# EAGLE design schema (EAGLE 9.6.0)
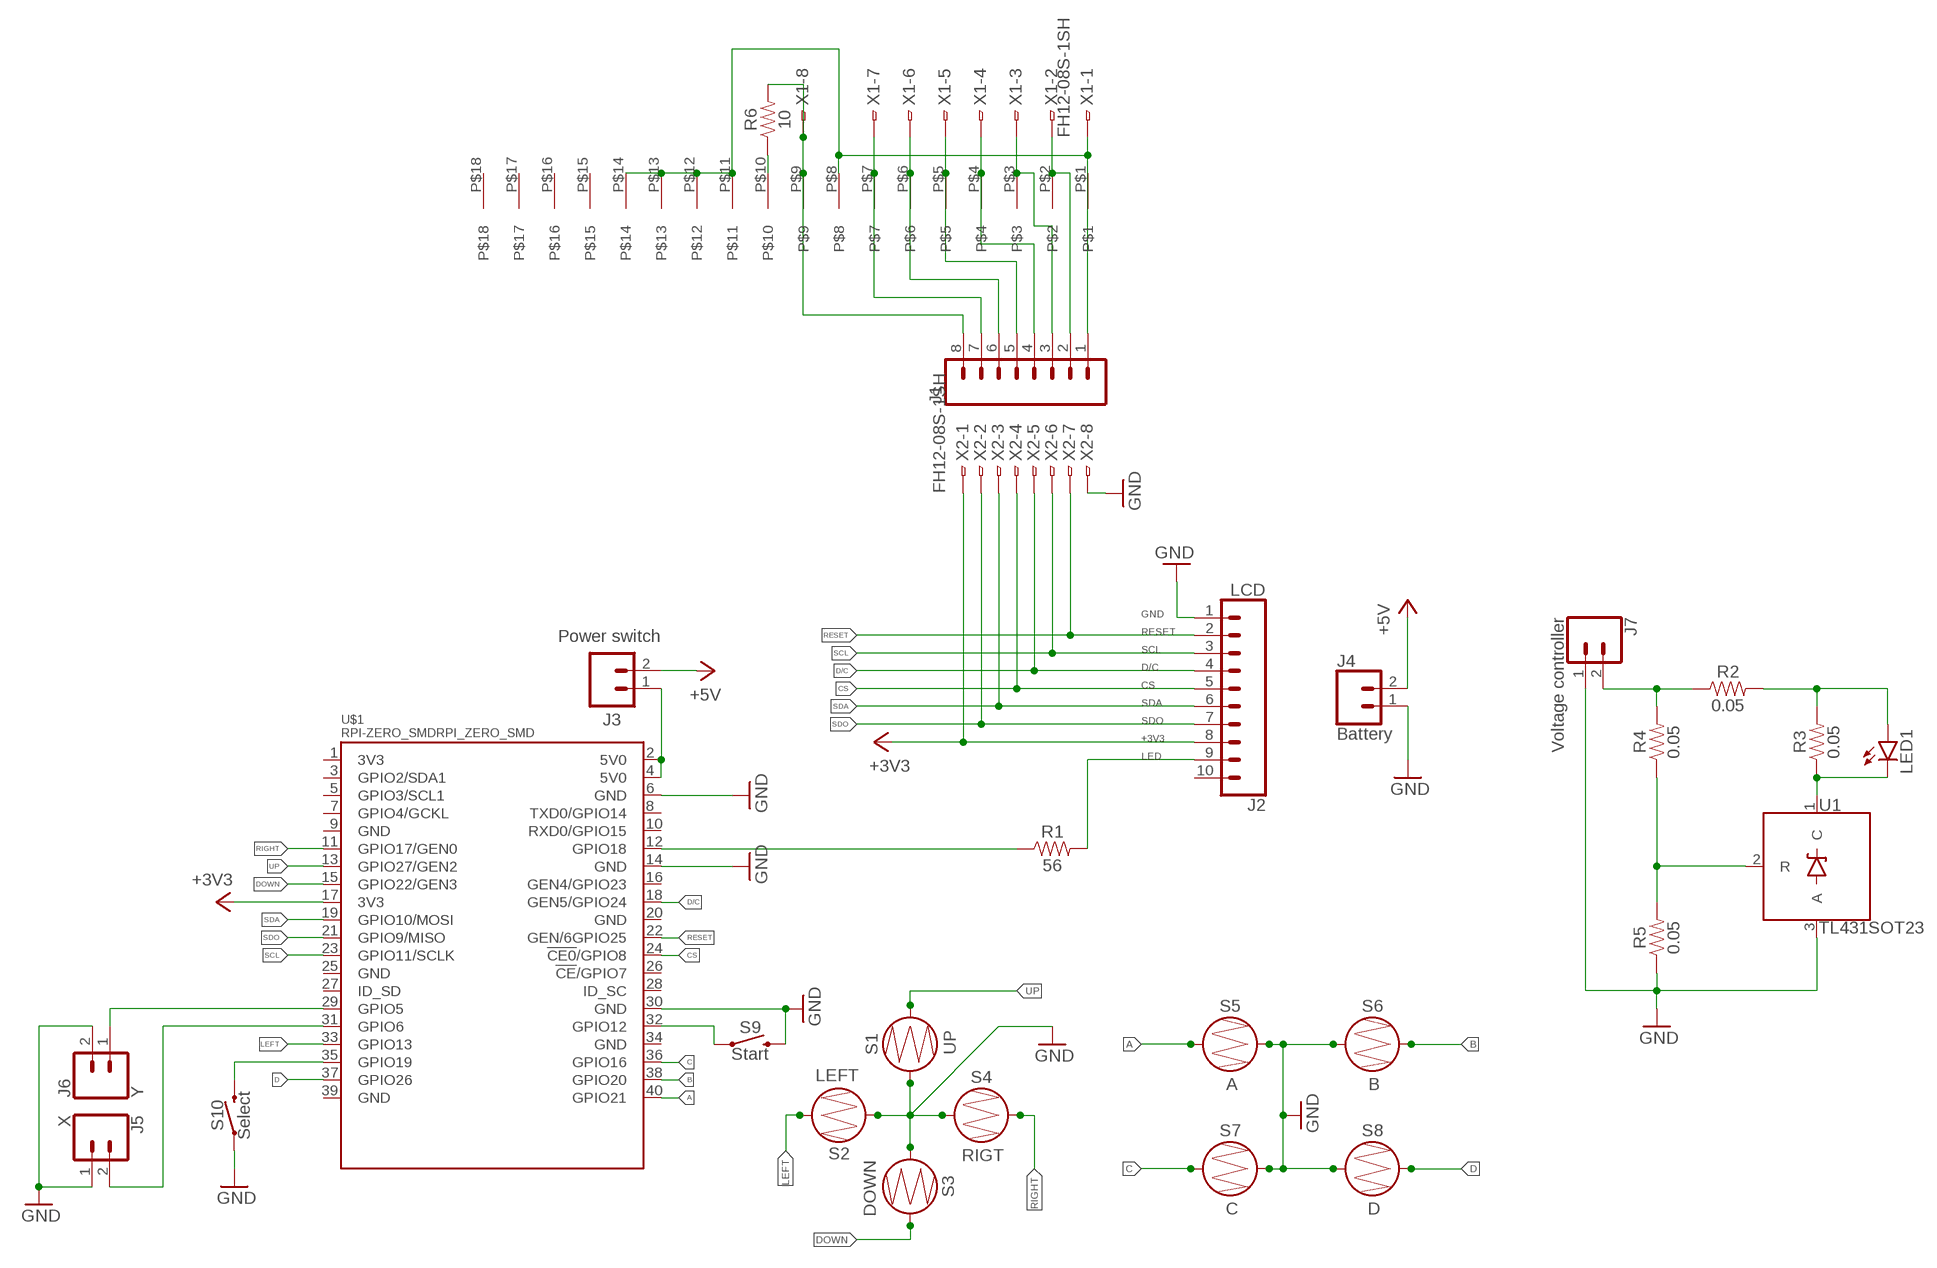
[diagram p0: schematic, sheet 1]

## Parts
J1  CONN_08"  [1X08]
J2  LCD  CONN_10NO_SILK_PTH_FEMALE  [1X10_NO_SILK]
J3  Power switch  CONN_02LOCK_LONGPADS  [1X02_LOCK_LONGPADS]
J4  Battery  CONN_02LOCK_LONGPADS  [1X02_LOCK_LONGPADS]
J5  X  CONN_02LOCK_LONGPADS  [1X02_LOCK_LONGPADS]
J6  Y  CONN_02LOCK_LONGPADS  [1X02_LOCK_LONGPADS]
J7  Voltage controller  CONN_02  [1X02]
LED1  LEDKA-3528ASYC  [KA-3528ASYC]
R1  56  0.05OHM-0603-1/5W-1%  [0603]
R2  0.05  0.05OHM-0603-1/5W-1%  [0603]
R3  0.05  0.05OHM-0603-1/5W-1%  [0603]
R4  0.05  0.05OHM-0603-1/5W-1%  [0603]
R5  0.05  0.05OHM-0603-1/5W-1%  [0603]
R6  10  0.05OHM-0603-1/5W-1%  [0603]
S1  UP  BUTTON-CONDUCTIVESMD  [BUTTON-CONDUCTIVE]
S2  LEFT  BUTTON-CONDUCTIVESMD  [BUTTON-CONDUCTIVE]
S3  DOWN  BUTTON-CONDUCTIVESMD  [BUTTON-CONDUCTIVE]
S4  RIGT  BUTTON-CONDUCTIVESMD  [BUTTON-CONDUCTIVE]
S5  A  BUTTON-CONDUCTIVESMD  [BUTTON-CONDUCTIVE]
S6  B  BUTTON-CONDUCTIVESMD  [BUTTON-CONDUCTIVE]
S7  C  BUTTON-CONDUCTIVESMD  [BUTTON-CONDUCTIVE]
S8  D  BUTTON-CONDUCTIVESMD  [BUTTON-CONDUCTIVE]
S9  Start  MOMENTARY-SWITCH-SPST-PTH-6.0MM-KIT  [TACTILE_SWITCH_PTH_6.0MM_KIT]
S10  Select  MOMENTARY-SWITCH-SPST-PTH-6.0MM-KIT  [TACTILE_SWITCH_PTH_6.0MM_KIT]
U1  TL431SOT23  [SOT23-3]
U$1  RPI-ZERO_SMDRPI_ZERO_SMD  [RASPBERRYPI_SMD]
U$2  ILI_LCD  [ILI_LCD]
X1  FH12-08S-1SH  [FH12-08S-1SH]
X2  FH12-08S-1SH  [FH12-08S-1SH]

## Nets
5V0@2: J3.1 U$1.2(5V0) U$1.4(5V0)
+3V3: J2.8 U$1.17(3V3) X2.1
+5V: J3.2 J4.2
A: S5.1 U$1.40(GPIO21)
B: S6.2 U$1.38(GPIO20)
C: S7.1 U$1.36(GPIO16)
CS: J2.5 U$1.24(!CE0!/GPIO8) X2.4
D: S8.2 U$1.37(GPIO26)
D/C: J2.4 U$1.18(GEN5/GPIO24) X2.5
DOWN: S3.2 U$1.15(GPIO22/GEN3)
GND: J2.1 J4.1 J5.1 J6.2 J7.1 R5.1 S1.1 S2.1 S3.1 S4.1 S5.2 S6.1 S7.2 S8.1 S9.3 S10.1 U1.3(A) U$1.6(GND) U$1.30(GND) X2.8
GND@4: U$1.14(GND) ; supply symbol labelled GND
LED: J2.9 R1.2
LEFT: S2.2 U$1.33(GPIO13)
N$1: J6.1 U$1.29(GPIO5)
N$2: R1.1 U$1.12(GPIO18)
N$3: J5.2 U$1.31(GPIO6)
N$4: S9.1 U$1.32(GPIO12)
N$5: S10.3 U$1.35(GPIO19)
N$6: J7.2 R2.1 R4.2
N$7: LED1.A R2.2 R3.2
N$8: LED1.C R3.1 U1.1(C)
N$9: R4.1 R5.2 U1.2(R)
N$10: R6.1 U$2.P$10
N$11: J1.2 U$2.P$2 X1.2
N$12: J1.3 U$2.P$3 X1.3
N$13: J1.4 U$2.P$4 X1.4
N$14: J1.5 U$2.P$5 X1.5
N$15: J1.6 U$2.P$6 X1.6
N$16: J1.7 U$2.P$7 X1.7
N$17: J1.8 R6.2 U$2.P$9 X1.8
N$18: J1.1 U$2.P$1 U$2.P$8 U$2.P$11 U$2.P$12 U$2.P$13 U$2.P$14 X1.1
RESET: J2.2 U$1.22(GEN/6GPIO25) X2.7
RIGHT: S4.2 U$1.11(GPIO17/GEN0)
SCL: J2.3 U$1.23(GPIO11/SCLK) X2.6
SDA: J2.6 U$1.19(GPIO10/MOSI) X2.3
SDO: J2.7 U$1.21(GPIO9/MISO) X2.2
UP: S1.2 U$1.13(GPIO27/GEN2)
Unconnected: J2.10 U$1.1(3V3) U$1.3(GPIO2/SDA1) U$1.5(GPIO3/SCL1) U$1.7(GPIO4/GCKL) U$1.8(TXD0/GPIO14) U$1.9(GND) U$1.10(RXD0/GPIO15) U$1.16(GEN4/GPIO23) U$1.20(GND) U$1.25(GND) U$1.26(!CE!/GPIO7) U$1.27(ID_SD) U$1.28(ID_SC) U$1.34(GND) U$1.39(GND) U$2.P$15 U$2.P$16 U$2.P$17 U$2.P$18

## Library data of the parts
J1 = SparkFun-Connectors:CONN_08: Multi connection point. Often used as Generic Header-pin footprint for 0.1 inch spaced/style header connections On any of the 0.1 inch spaced packages, you can populate with these: Break Away Headers - Straight <https://www.sparkfun.com/products/116> (PRT-00116) Break Away Male Headers - Right Angle <https://www.sparkfun.com/products/553> (PRT-00553) Female Headers <https://www.sparkfun.com/products/115> (PRT-00115) Break Away Headers - Machine Pin <https://www.sparkfun.com/products/117> (PRT-00117) Break Away Female Headers - Swiss Machine Pin <https://www.sparkfun.com/products/743> (PRT-00743) Arduino Stackable Header - 8 Pin <https://www.sparkfun.com/products/9279> (PRT-09279) For SCREWTERMINALS and SPRING TERMINALS visit here: Screw Terimnals on SparkFun.com <https://www.sparkfun.com/search/results?term=Screw+Terminals> (5mm/3.5mm/2.54mm spacing) This device is also useful as a general connection point to wire up your design to another part of your project. Our various solder wires solder well into these plated through hole pads. Hook-Up Wire - Assortment (Stranded, 22 AWG) <https://www.sparkfun.com/products/11375> (PRT-11375) Hook-Up Wire - Assortment (Solid Core, 22 AWG) <https://www.sparkfun.com/products/11367> (PRT-11367) View the entire wire category on our website here <https://www.sparkfun.com/categories/141> Special notes: Molex polarized connector foot print use with SKU : PRT-08231 with associated crimp pins and housings. 1MM SMD Version SKU: PRT-10208 NOTES ON THE VARIANTS LOCK and LOCK_LONGPADS... This footprint was designed to help hold the alignment of a through-hole component (i.e. 6-pin header) while soldering it into place. You may notice that each hole has been shifted either up or down by 0.005 of an inch from it's more standard position (which is a perfectly straight line). This slight alteration caused the pins (the squares in the middle) to touch the edges of the holes. Because they are alternating, it causes a "brace" to hold the component in place. 0.005 has proven to be the perfect amount of "off-center" position when using our standard breakaway headers. Although looks a little odd when you look at the bare footprint, once you have a header in there, the alteration is very hard to notice. Also,if you push a header all the way into place, it is covered up entirely on the bottom side.; PROD_ID: CONN-08438
J2 = SparkFun-Connectors:CONN_10: Multi connection point. Often used as Generic Header-pin footprint for 0.1 inch spaced/style header connections On any of the 0.1 inch spaced packages, you can populate with these: Break Away Headers - Straight <https://www.sparkfun.com/products/116> (PRT-00116) Break Away Male Headers - Right Angle <https://www.sparkfun.com/products/553> (PRT-00553) Female Headers <https://www.sparkfun.com/products/115> (PRT-00115) Break Away Headers - Machine Pin <https://www.sparkfun.com/products/117> (PRT-00117) Break Away Female Headers - Swiss Machine Pin <https://www.sparkfun.com/products/743> (PRT-00743) Arduino Stackable Header - 10 Pin <https://www.sparkfun.com/products/11376> (PRT-11376) For SCREWTERMINALS and SPRING TERMINALS visit here: Screw Terimnals on SparkFun.com <https://www.sparkfun.com/search/results?term=Screw+Terminals> (5mm/3.5mm/2.54mm spacing) This device is also useful as a general connection point to wire up your design to another part of your project. Our various solder wires solder well into these plated through hole pads. Hook-Up Wire - Assortment (Stranded, 22 AWG) <https://www.sparkfun.com/products/11375> (PRT-11375) Hook-Up Wire - Assortment (Solid Core, 22 AWG) <https://www.sparkfun.com/products/11367> (PRT-11367) View the entire wire category on our website here <https://www.sparkfun.com/categories/141> Special notes: Molex polarized connector foot print use with SKU : PRT-08231 with associated crimp pins and housings. 1MM SMD Version SKU: PRT-10208 NOTES ON THE VARIANTS LOCK and LOCK_LONGPADS... This footprint was designed to help hold the alignment of a through-hole component (i.e. 6-pin header) while soldering it into place. You may notice that each hole has been shifted either up or down by 0.005 of an inch from it's more standard position (which is a perfectly straight line). This slight alteration caused the pins (the squares in the middle) to touch the edges of the holes. Because they are alternating, it causes a "brace" to hold the component in place. 0.005 has proven to be the perfect amount of "off-center" position when using our standard breakaway headers. Although looks a little odd when you look at the bare footprint, once you have a header in there, the alteration is very hard to notice. Also,if you push a header all the way into place, it is covered up entirely on the bottom side.; PROD_ID: CONN-11563
J3-J7 = SparkFun-Connectors:CONN_02: Multi connection point. Often used as Generic Header-pin footprint for 0.1 inch spaced/style header connections On any of the 0.1 inch spaced packages, you can populate with these: Break Away Headers - Straight <https://www.sparkfun.com/products/116> (PRT-00116) Break Away Male Headers - Right Angle <https://www.sparkfun.com/products/553> (PRT-00553) Female Headers <https://www.sparkfun.com/products/115> (PRT-00115) Break Away Headers - Machine Pin <https://www.sparkfun.com/products/117> (PRT-00117) Break Away Female Headers - Swiss Machine Pin <https://www.sparkfun.com/products/743> (PRT-00743) For SCREWTERMINALS and SPRING TERMINALS visit here: Screw Terimnals on SparkFun.com <https://www.sparkfun.com/search/results?term=Screw+Terminals> (5mm/3.5mm/2.54mm spacing) This device is also useful as a general connection point to wire up your design to another part of your project. Our various solder wires solder well into these plated through hole pads. Hook-Up Wire - Assortment (Stranded, 22 AWG) <https://www.sparkfun.com/products/11375> (PRT-11375) Hook-Up Wire - Assortment (Solid Core, 22 AWG) <https://www.sparkfun.com/products/11367> (PRT-11367) View the entire wire category on our website here <https://www.sparkfun.com/categories/141> Special notes: Molex polarized connector foot print use with: PRT-08233 with associated crimp pins and housings. 2.54_SCREWTERM for use with PRT-10571. 3.5mm Screw Terminal footprints for PRT-08084 5mm Screw Terminal footprints for use with PRT-08432
LED1 = led:LED: LED OSRAM: - CHIPLED LG R971, LG N971, LY N971, LG Q971, LY Q971, LO R971, LY R971 LH N974, LH R974 LS Q976, LO Q976, LY Q976 LO Q996 - Hyper CHIPLED LW Q18S LB Q993, LB Q99A, LB R99A - SideLED LS A670, LO A670, LY A670, LG A670, LP A670 LB A673, LV A673, LT A673, LW A673 LH A674 LY A675 LS A676, LA A676, LO A676, LY A676, LW A676 LS A679, LY A679, LG A679 - Hyper Micro SIDELED® LS Y876, LA Y876, LO Y876, LY Y876 LT Y87S - SmartLED LW L88C, LW L88S LB L89C, LB L89S, LG L890 LS L89K, LO L89K, LY L89K LS L896, LA L896, LO L896, LY L896 - TOPLED LS T670, LO T670, LY T670, LG T670, LP T670 LSG T670, LSP T670, LSY T670, LOP T670, LYG T670 LG T671, LOG T671, LSG T671 LB T673, LV T673, LT T673, LW T673 LH T674 LS T676, LA T676, LO T676, LY T676, LB T676, LH T676, LSB T676, LW T676 LB T67C, LV T67C, LT T67C, LS T67K, LO T67K, LY T67K, LW E67C LS E67B, LA E67B, LO E67B, LY E67B, LB E67C, LV E67C, LT E67C LW T67C LS T679, LY T679, LG T679 LS T770, LO T770, LY T770, LG T770, LP T770 LB T773, LV T773, LT T773, LW T773 LH T774 LS E675, LA E675, LY E675, LS T675 LS T776, LA T776, LO T776, LY T776, LB T776 LHGB T686 LT T68C, LB T68C - Hyper Mini TOPLED® LB M676 - Mini TOPLED Santana® LG M470 LS M47K, LO M47K, LY M47K Source: http://www.osram.convergy.de LUXEON: - LUMILED® LXK2-PW12-R00, LXK2-PW12-S00, LXK2-PW14-U00, LXK2-PW14-V00 LXK2-PM12-R00, LXK2-PM12-S00, LXK2-PM14-U00 LXK2-PE12-Q00, LXK2-PE12-R00, LXK2-PE12-S00, LXK2-PE14-T00, LXK2-PE14-U00 LXK2-PB12-K00, LXK2-PB12-L00, LXK2-PB12-M00, LXK2-PB14-N00, LXK2-PB14-P00, LXK2-PB14-Q00 LXK2-PR12-L00, LXK2-PR12-M00, LXK2-PR14-Q00, LXK2-PR14-R00 LXK2-PD12-Q00, LXK2-PD12-R00, LXK2-PD12-S00 LXK2-PH12-R00, LXK2-PH12-S00 LXK2-PL12-P00, LXK2-PL12-Q00, LXK2-PL12-R00 Source: www.luxeon.com KINGBRIGHT: KA-3528ASYC Source: www.kingbright.com
R1 R6 = SparkFun-Resistors:0.05OHM: 0.05Ω resistor A resistor is a passive two-terminal electrical component that implements electrical resistance as a circuit element. Resistors act to reduce current flow, and, at the same time, act to lower voltage levels within circuits. - Wikipedia; PROD_ID: RES-12535; VALUE: 0.05
R2-R5 = SparkFun-Resistors:0.05OHM: 0.05Ω resistor A resistor is a passive two-terminal electrical component that implements electrical resistance as a circuit element. Resistors act to reduce current flow, and, at the same time, act to lower voltage levels within circuits. - Wikipedia; PROD_ID: RES-12535
S1-S8 = RPI-Zero:BUTTON-CONDUCTIVE: Conductive Button Used with rubber key pads on the Nordic Key FOB <https://www.sparkfun.com/products/retired/8602>. This one was designed and proven to work with the PolyCase Key FOB enclosures <https://www.sparkfun.com/products/retired/9377>. SparkFun Products Nordic Fob <https://www.sparkfun.com/products/retired/8602> (WRL-08602)
S9 S10 = SparkFun-Switches:MOMENTARY-SWITCH-SPST: Momentary Switch (Pushbutton) - SPST Normally-open (NO) SPST momentary switches (buttons, pushbuttons). Variants PTH-12MM - 12mm square, through-hole Momentary Pushbutton Switch - 12mm Square <https://www.sparkfun.com/products/9190> (COM-09190) PTH-6.0MM, PTH-6.0MM-KIT - 6.0mm square, through-hole Mini Pushbutton Switch <https://www.sparkfun.com/products/97> (COM-00097) KIT package intended for soldering kit's - only one side of pads' copper is exposed. PTH-RIGHT-ANGLE-KIT - Right-angle, through-hole Right Angle Tactile Button <https://www.sparkfun.com/products/10791> - Used on SparkFun BigTime Watch Kit <https://www.sparkfun.com/products/11734> SMD-12MM - 12mm square, surface-mount Tactile Button - SMD (12mm) <https://www.sparkfun.com/products/12993> (COM-12993) Used on SparkFun PicoBoard <https://www.sparkfun.com/products/11888> SMD-4.5MM - 4.5mm Square Trackball Switch Used on SparkFun Blackberry Trackballer Breakout <https://www.sparkfun.com/products/13169> SMD-4.6MMX2.8MM - 4.60mm x 2.80mm, surface mount Used on SparkFun SAMD21 Mini Breakout <https://www.sparkfun.com/products/13664> SMD-5.2MM, SMD-5.2-REDUNDANT - 5.2mm square, surface-mount Mini Pushbutton Switch - SMD <https://www.sparkfun.com/products/8720> (COM-08720) Used on Arduino Pro Mini <https://www.sparkfun.com/products/11114> REDUNDANT package connects both switch circuits together SMD-6.0X3.5MM - 6.0 x 3.5mm, surface mount Momentary Reset Switch SMD <https://www.sparkfun.com/products/8229> (COM-08229) SMD-6.2MM-TALL - 6.2mm square, surface mount Tactile Button - SMD (6mm) <https://www.sparkfun.com/products/12992> Used on SparkFun Digital Sandbox <https://www.sparkfun.com/products/12651> SMD-RIGHT-ANGLE - Right-angle, surface mount Used on SparkFun Block for Intel® Edison - Arduino <https://www.sparkfun.com/products/13036>; PROD_ID: SWCH-08441; SF_SKU: COM-00097
U1 = Kristan:TL431: TL431- Voltage Reference Precision Programmable Shunt Regulator Diode Datasheet <https://cdn.sparkfun.com/datasheets/Components/General%20IC/TL431-D.pdf> SparkFun Products: TL431-Voltage Reference PTH <https://www.sparkfun.com/products/11078> SparkFun Uh-Oh Battery Level Indicator <https://www.sparkfun.com/products/11087>
U$1 = RPI-Zero:RPI-ZERO_SMD
U$2 = RPI-Zero:ILI_LCD
X1 X2 = con-hirose:FH12-08S-1S: 1mm Pitch Connectors For FPC/FFC Source: Data sheet <http://www.hirose.co.jp/cataloge_hp/e58605370.pdf>; OC_FARNELL: unknown; OC_NEWARK: unknown

## Board
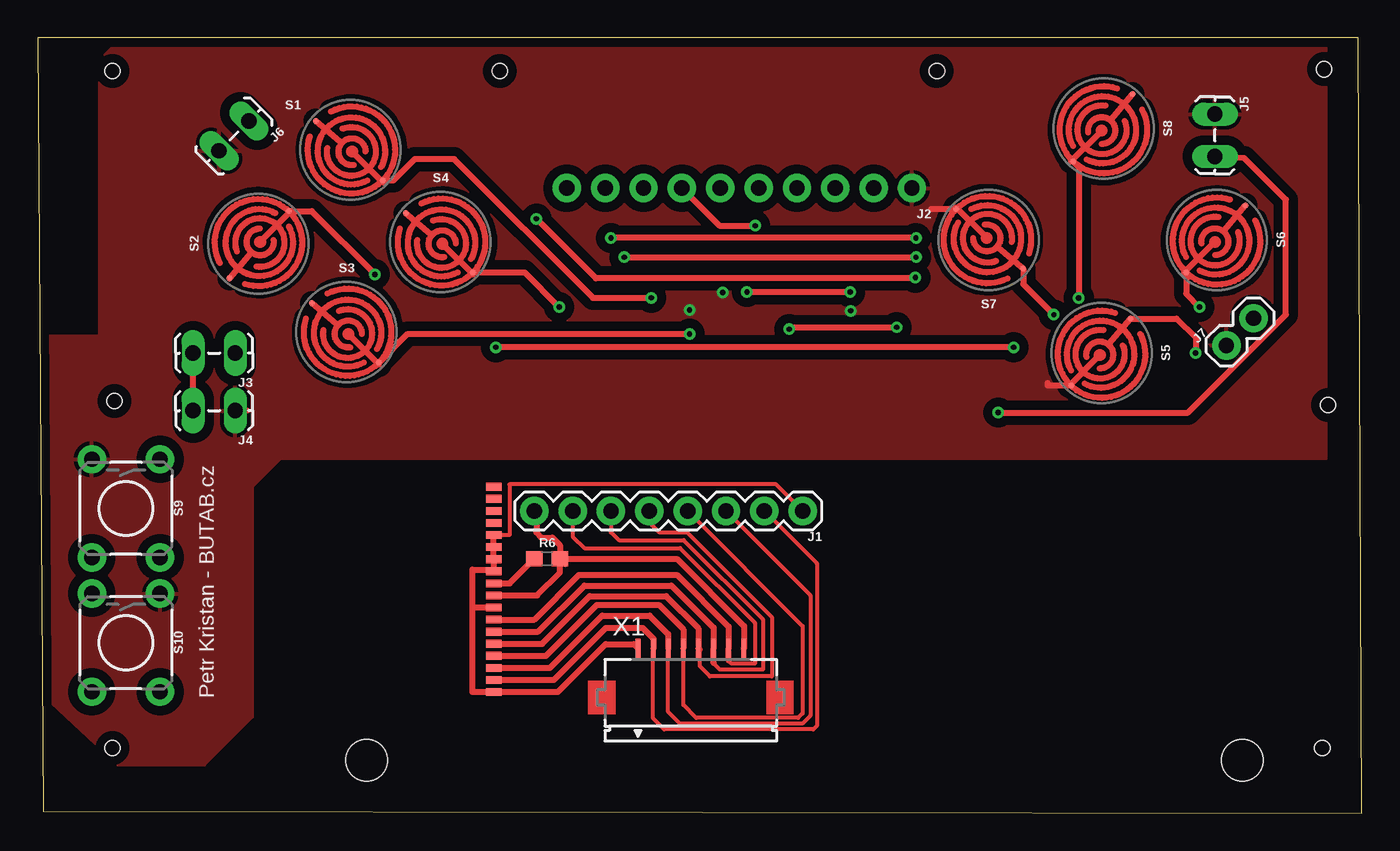
[diagram p1: board, top side]
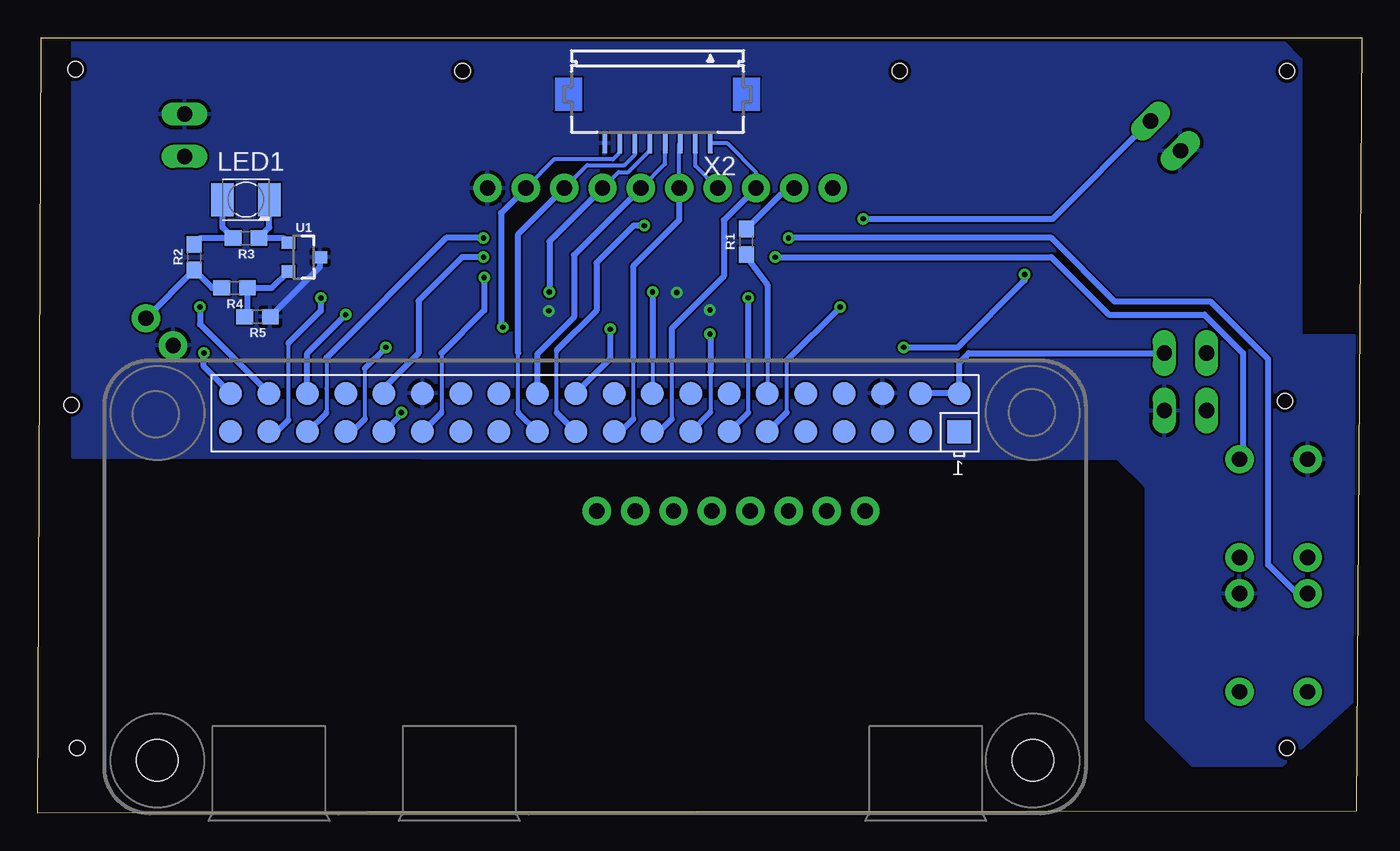
[diagram p2: board, bottom side, seen from below]

Size 87.71 x 51.34 mm. Coordinates in mm from the lower left corner, seen from the top.
Outline: 0.35,0.13 87.71,0 87.48,51.34 0,51.34 0.35,0.13
Copper layers (1*16): Top 0.035mm / dielectric 1.6mm / Bottom 0.035mm
Design rules "orca_share_media1586889184955": minimum track width 5mil, minimum drill 0.2mm, track to track 5mil, track to pad 8mil, pad to pad 8mil, via to via 8mil, smd to smd 8mil, copper to edge 10mil, drill to drill 8mil, minimum pad ring 10mil, minimum via ring 8mil, stop-mask expansion 4mil, vias tented up to drill 0.7mm, thermal gap 10mil
Holes 1 mm at 4.95,49.13 30.61,49.13 59.56,49.13 5.08,27.29 4.95,4.3 85.09,4.3 85.47,27.04 85.22,49.26

### Footprints (pad centres in the part's own frame; a part is rotated, then mirrored left to right if it is on the bottom)
1X08 = drill 1.016 pad 1.88: 1 0,0; 2 2.54,0; 3 5.08,0; 4 7.62,0; 5 10.16,0; 6 12.7,0; 7 15.24,0; 8 17.78,0
1X10_NO_SILK = drill 1.016 pad 1.88: 1 0,0; 2 2.54,0; 3 5.08,0; 4 7.62,0; 5 10.16,0; 6 12.7,0; 7 15.24,0; 8 17.78,0; 9 20.32,0; 10 22.86,0
1X02_LOCK_LONGPADS = drill 1.016 long: 1 -0.127,0; 2 2.667,0
1X02 = drill 1.016 pad 1.88: 1 0,0; 2 2.54,0
KA-3528ASYC = smd 1.5 x 2.2: A -1.55,0; C 1.55,0
0603 = smd 1.1 x 1: 1 -0.85,0; 2 0.85,0
BUTTON-CONDUCTIVE = smd 0.406 x 0.406: 1 -2.032,-2.413; 2 1.905,2.032
TACTILE_SWITCH_PTH_6.0MM_KIT = drill 1.016 pad 1.88: 1 -3.251,2.261; 2 3.251,2.261; 3 -3.251,-2.261; 4 3.251,-2.261
SOT23-3 = smd 0.8 x 0.9: 1 -0.95,-1; 2 0.95,-1; 3 0,1.1
RASPBERRYPI_SMD = smd 1.524 x 1.524 bottom: 1 8.382,25.273; 2 8.382,27.813; 3 10.922,25.273; 4 10.922,27.813; 5 13.462,25.273; 6 13.462,27.813; 7 16.002,25.273; 8 16.002,27.813; 9 18.542,25.273; 10 18.542,27.813; 11 21.082,25.273; 12 21.082,27.813; 13 23.622,25.273; 14 23.622,27.813; 15 26.162,25.273; 16 26.162,27.813; 17 28.702,25.273; 18 28.702,27.813; 19 31.242,25.273; 20 31.242,27.813; 21 33.782,25.273; 22 33.782,27.813; 23 36.322,25.273; 24 36.322,27.813; 25 38.862,25.273; 26 38.862,27.813; 27 41.402,25.273; 28 41.402,27.813; 29 43.942,25.273; 30 43.942,27.813; 31 46.482,25.273; 32 46.482,27.813; 33 49.022,25.273; 34 49.022,27.813; 35 51.562,25.273; 36 51.562,27.813; 37 54.102,25.273; 38 54.102,27.813; 39 56.642,25.273; 40 56.642,27.813 | hole 2.75: 3.5,3.5; 61.5,3.5
ILI_LCD = smd 0.508 x 1.016: P$1 0,0; P$2 0.8,0; P$3 1.6,0; P$4 2.4,0; P$5 3.2,0; P$6 4,0; P$7 4.8,0; P$8 5.6,0; P$9 6.4,0; P$10 7.2,0; P$11 8,0; P$12 8.8,0; P$13 9.6,0; P$14 10.4,0; P$15 11.2,0; P$16 12,0; P$17 12.8,0; P$18 13.6,0
FH12-08S-1SH = smd 0.3 x 1.3: 1 -3.5,3.25; 2 -2.5,3.25; 3 -1.5,3.25; 4 -0.5,3.25; 5 0.5,3.25; 6 1.5,3.25; 7 2.5,3.25; 8 3.5,3.25

### Placement (x,y rotation side)
J1  50.67,20.01 180 top
J2  57.91,41.39 180 top
J3  12.95,30.47 180 top
J4  12.95,26.66 180 top
J5  77.98,46.16 270 top
J6  13.9,45.75 225 top
J7  78.74,30.97 45 top
LED1  73.91,40.63 0 bottom
R1  40.77,37.83 90 bottom
R2  77.34,36.82 90 bottom
R3  73.91,38.09 180 bottom
R4  74.68,34.78 180 bottom
R5  73.15,32.88 180 bottom
R6  33.74,16.83 0 top
S1  20.83,43.8 270 top
S2  14.73,37.83 0 top
S3  20.57,31.74 270 top
S4  26.8,37.7 270 top
S5  70.36,30.34 180 top
S6  77.98,37.83 180 top
S7  62.86,38.09 90 top
S8  70.48,45.2 180 top
S9  5.84,20.18 270 top
S10  5.84,11.29 270 top
U1  70.1,36.82 270 bottom
U$1  18.29,-0.01 0 top
U$2  30.21,8.02 90 top
X1  43.27,7.66 0 top
X2  46.65,47.6 180 bottom

### Tracks (layer width: path | path; a pad name or v marks a point on that pad's centre or on a via)
5V0@2
  Bottom 0.406: U$1.4 U$1.2 26.67,29.83 26.04,30.47 J3.1
+3V3
  Bottom 0.254: 45.72,30.08 45.72,26.09 | U$1.17 46.55,25.26 | J2.8 40.13,42.45 42.03,44.35 X2.1
  Bottom 0.406: 46.55,25.26 45.72,26.09 | J2.8 42.25,39.27 42.25,35.56 45.72,32.09 45.72,30.08
+5V
  Top 0.406: J4.2 J3.2
A  (via drill 0.35)
  Top 0.406: S5.1 75.44,32.75 76.71,31.48 v76.71,30.47
  Bottom 0.406: U$1.40 76.71,29.58 v76.71,30.47
B  (via drill 0.35)
  Top 0.406: S6.2 76.07,34.4 v76.96,33.51
  Bottom 0.406: U$1.38 76.96,32.37 v76.96,33.51
C  (via drill 0.35)
  Top 0.406: v67.31,33.01 65.28,35.04 S7.1
  Bottom 0.406: U$1.36 69.85,30.47 v67.31,33.01
CS
  Bottom 0.254: J2.5 46.15,42.99 X2.4
  Bottom 0.406: J2.5 52.2,36.94 52.2,32.82 54.61,30.41 U$1.24
D  (via drill 0.35)
  Top 0.406: S8.2 68.96,42.78 v68.96,34.12
  Bottom 0.254: 71.12,31.1 71.12,26.02 | 71.88,25.26 U$1.37
  Bottom 0.406: 71.12,31.1 68.96,33.26 v68.96,34.12 | 71.12,26.02 71.88,25.26
D/C  (via drill 0.35)
  Top 0.406: v46.98,34.5 v53.82,34.5
  Bottom 0.254: 46.99,29.96 U$1.18 | X2.5 47.15,43.89 48.6,42.45 49.23,42.45 J2.4
  Bottom 0.406: J2.4 53.82,37.86 v53.82,34.5 | v46.98,34.5 46.99,34.49 46.99,29.96
DOWN  (via drill 0.35)
  Top 0.406: S3.2 24.51,31.74 v43.18,31.74
  Bottom 0.254: 43.14,29.2 43.14,26.57
  Bottom 0.406: U$1.15 43.14,26.57 | v43.18,31.74 43.14,31.7 43.14,29.2
GND  (via drill 0.35)
  Top 0.406: 13.84,26.66 J4.1 | S7.2 59.18,39.99 | S5.2 66.9,28.31 66.9,28.48
  Bottom 0.406: R5.1 69,36.18 U1.3
  other vias: 43.18,33.32 53.85,33.26 45.38,34.47
  pour Top (isolate 0.61): 85.34,51.17 5.33,51.17 4.06,49.86 4.06,31.61 0.27,31.61 0.38,7.72 5.28,3.16 11.05,3.16 14.22,6.34 14.22,21.58 16.13,23.48 85.34,23.48
  pour Bottom: 5.33,51.17 4.06,49.9 4.06,31.61 0.51,31.61 0.62,7.42 5.31,3.16 11.18,3.16 14.23,6.21 14.23,21.7 14.35,21.7 16.13,23.48 85.34,23.56 85.34,51.17
LED
  Bottom 0.152: J2.9 37.59,41.74
  Bottom 0.254: J2.9 37.76,41.22
  Bottom 0.406: J2.9 38.06,41.39 R1.2
LEFT  (via drill 0.35)
  Top 0.406: S2.2 18.15,39.86 v22.34,35.67 | v64.64,30.85 v30.35,30.85
  Bottom 0.254: 66.04,29.45 66.04,26.09 | U$1.33 66.87,25.26
  Bottom 0.406: 66.87,25.26 66.04,26.09 | v64.64,30.85 66.04,29.45 | v30.35,30.85 26.77,30.85 22.34,35.28 v22.34,35.67
N$1  (via drill 0.35)
  Top 0.254: v58.14,35.46 58.14,35.28
  Top 0.406: v58.14,35.46 58.09,35.42 36.97,35.42 v33.03,39.36 | 13.99,45.96 J6.1
  Bottom 0.254: 60.96,30.47 60.96,26.53
  Bottom 0.406: 60.96,26.53 U$1.29 | v58.14,35.46 58.14,33.29 60.96,30.47 | v33.03,39.36 20.47,39.36 J6.1
N$2
  Bottom 0.254: 39.37,30.08 U$1.12
  Bottom 0.406: R1.1 40.77,36.85 39.37,34.97 39.37,30.08
N$3  (via drill 0.35)
  Top 0.406: J5.2 79.92,43.38 82.68,40.63 82.68,33.01 76.2,26.53 v63.63,26.53
  Bottom 0.254: 63.63,26.4 v63.63,26.53
  Bottom 0.406: U$1.31 63.63,26.4
N$4  (via drill 0.35)
  Top 0.406: v38.86,36.82 v58.18,36.82
  Bottom 0.406: v38.86,36.82 20.57,36.82 16.76,33.01 10.41,33.01 7.87,30.47 7.87,23.66 S9.1 | v58.18,36.82 59.59,36.82 62.48,33.92 62.48,30.47 64.77,28.18 U$1.32
N$5  (via drill 0.35)
  Top 0.406: v58.18,38.09 v37.97,38.09
  Bottom 0.254: 68.58,30.16 68.58,28.12 68.58,26.53
  Bottom 0.406: v37.97,38.09 20.57,38.09 16.38,33.89 10.03,33.89 6.22,30.08 6.22,16.5 | 68.58,26.53 U$1.35 | v58.18,38.09 60.65,38.09 68.58,30.16 | 6.22,16.5 6.22,16.42 | S10.3 4.27,14.54 6.22,16.5
N$6
  Bottom 0.254: 75.53,35.16 R4.2
  Bottom 0.406: R4.2 76.16,34.78 R2.1 J7.2
N$7
  Bottom 0.254: R3.2 74.76,37.7
  Bottom 0.406: R2.2 76.92,38.09 R3.2 | R3.2 75.18,38.51 | R3.2 75.46,38.79 LED1.A
N$8
  Bottom 0.406: U1.1 71.42,38.09 R3.1 | R3.1 72.64,38.51 | R3.1 72.36,38.79 LED1.C
N$9
  Bottom 0.406: U1.2 72.19,34.78 R4.1 73.83,33.05 R5.2
N$10
  Top 0.406: U$2.P$10 31.27,15.21 R6.1
N$11
  Top 0.254: J1.2 51.6,16.54 51.6,5.77 51.38,5.55 41.5,5.55 40.77,6.28 X1.2
  Top 0.406: U$2.P$2 34.19,8.81 37.62,12.25 40.09,12.25 40.8,11.54 40.8,10.94 X1.2
N$12
  Top 0.254: J1.3 51.18,14.42 51.18,6.46 50.64,5.93 42.54,5.93 41.77,6.71 X1.3
  Top 0.406: U$2.P$3 33.93,9.61 37.39,13.08 40.54,13.08 41.77,11.86 X1.3
N$13
  Top 0.254: J1.4 50.67,12.39 50.67,6.6 50.38,6.31 43.62,6.31 42.77,7.16 X1.4
  Top 0.406: U$2.P$4 33.67,10.41 37.04,13.79 41.15,13.79 42.77,12.17 X1.4
N$14
  Top 0.254: J1.5 40.51,19.24 41.15,18.61 43,18.61 48.63,12.98 48.63,9.05 44.53,9.05 43.86,9.73 43.86,10.82
  Top 0.406: U$2.P$5 33.41,11.21 36.56,14.36 41.63,14.36 43.77,12.23 X1.5 43.86,10.82
N$15
  Top 0.254: 44.77,9.93 45.2,9.5 48.03,9.5 48.03,12.82 42.78,18.07 38.5,18.07 37.97,18.6 J1.6
  Top 0.406: U$2.P$6 33.15,12.01 36.21,15.07 41.98,15.07 44.77,12.29 X1.6 44.77,9.93
N$16
  Top 0.254: J1.7 35.43,18.32 36.21,17.54 42.56,17.54 47.5,12.6 47.5,9.91 45.96,9.91 45.77,10.1
  Top 0.406: U$2.P$7 32.89,12.81 35.86,15.78 42.33,15.78 45.77,12.34 X1.7 45.77,10.1
N$17
  Top 0.406: R6.2 34.94,16.48 | R6.2 42.33,16.83 46.79,12.38 46.79,10.94 X1.8 | U$2.P$9 33.08,14.41 34.59,15.92 R6.2 | J1.8 33.03,19.87 33.03,18.6 | 33.03,18.6 | 33.03,18.6 33.39,18.25 34.09,18.25 34.59,17.75 R6.2
N$18
  Top 0.254: J1.1 48.91,21.77 31.27,21.77 31.24,21.74 31.24,18.4 30.23,18.4 U$2.P$14
  Top 0.406: 28.8,13.66 28.8,8.01 U$2.P$1 34.45,8.01 37.62,11.19 39.49,11.19 X1.1 | U$2.P$8 28.85,13.61 28.8,13.66 | 28.8,13.66 28.8,16.13 30.1,16.13 | 30.1,16.13 U$2.P$11 | 30.1,16.13 30.21,16.24 U$2.P$12 U$2.P$13 U$2.P$14
RESET  (via drill 0.35)
  Top 0.406: v49.78,32.05 49.91,32.17 v56.9,32.17
  Bottom 0.254: 57.02,32.17 v56.9,32.17 | X2.7 49.15,43.76 49.61,43.29 53.5,43.29 55.37,41.42
  Bottom 0.406: 57.02,32.17 57.02,39.74 J2.2 55.37,41.42 | v49.78,32.05 49.78,30.08 U$1.22
RIGHT  (via drill 0.35)
  Top 0.406: S4.2 32.26,35.8 v34.54,33.51
  Bottom 0.254: 38.1,29.96 38.1,26.53
  Bottom 0.406: U$1.11 38.1,26.53 | v34.54,33.51 38.1,29.96
SCL
  Bottom 0.254: 55.88,26.53 55.88,30.47 | X2.6 48.15,43.6 48.84,42.91 51.31,42.91 J2.3
  Bottom 0.406: U$1.23 55.88,26.53 | J2.3 55.88,38.34 55.88,30.47
SDA
  Bottom 0.152: 45.16,41.39 J2.6
  Bottom 0.254: 48.26,29.96 48.26,26.09 | U$1.19 49.09,25.26 | J2.6 45.21,44.29 X2.3
  Bottom 0.406: 49.09,25.26 48.26,26.09 | J2.6 45.21,39.27 48.26,36.22 48.26,29.96
SDO  (via drill 0.35)
  Top 0.406: J2.7 45.16,38.9 v47.53,38.9
  Bottom 0.254: 53.34,26.53 53.34,30.63 | J2.7 44.15,42.87 X2.2
  Bottom 0.406: U$1.21 53.34,26.53 | v47.53,38.9 48.23,38.9 50.7,36.43 50.7,33.27 53.34,30.63
UP  (via drill 0.35)
  Top 0.406: v40.64,34.12 36.77,34.12 27.59,43.31 24.98,43.31 23.57,41.9 S1.2
  Bottom 0.254: 40.64,26.53 40.64,29.96
  Bottom 0.406: 40.64,29.96 v40.64,34.12 | U$1.13 40.64,26.53

### Text on the board
tPlace: Petr Kristan - BUTAB.cz